# EasyEDA Pro project OLED_UI.eprj

# Schematic Schematic1
Board Name: Board1; Create Date: 2025-05-31; Page Name: P1; Project Name: OLED_UI; Schematic Name: Schematic1; Update Date: 2025-06-29; Company: 嘉立创EDA; Page Size: A4; Version: V1.0
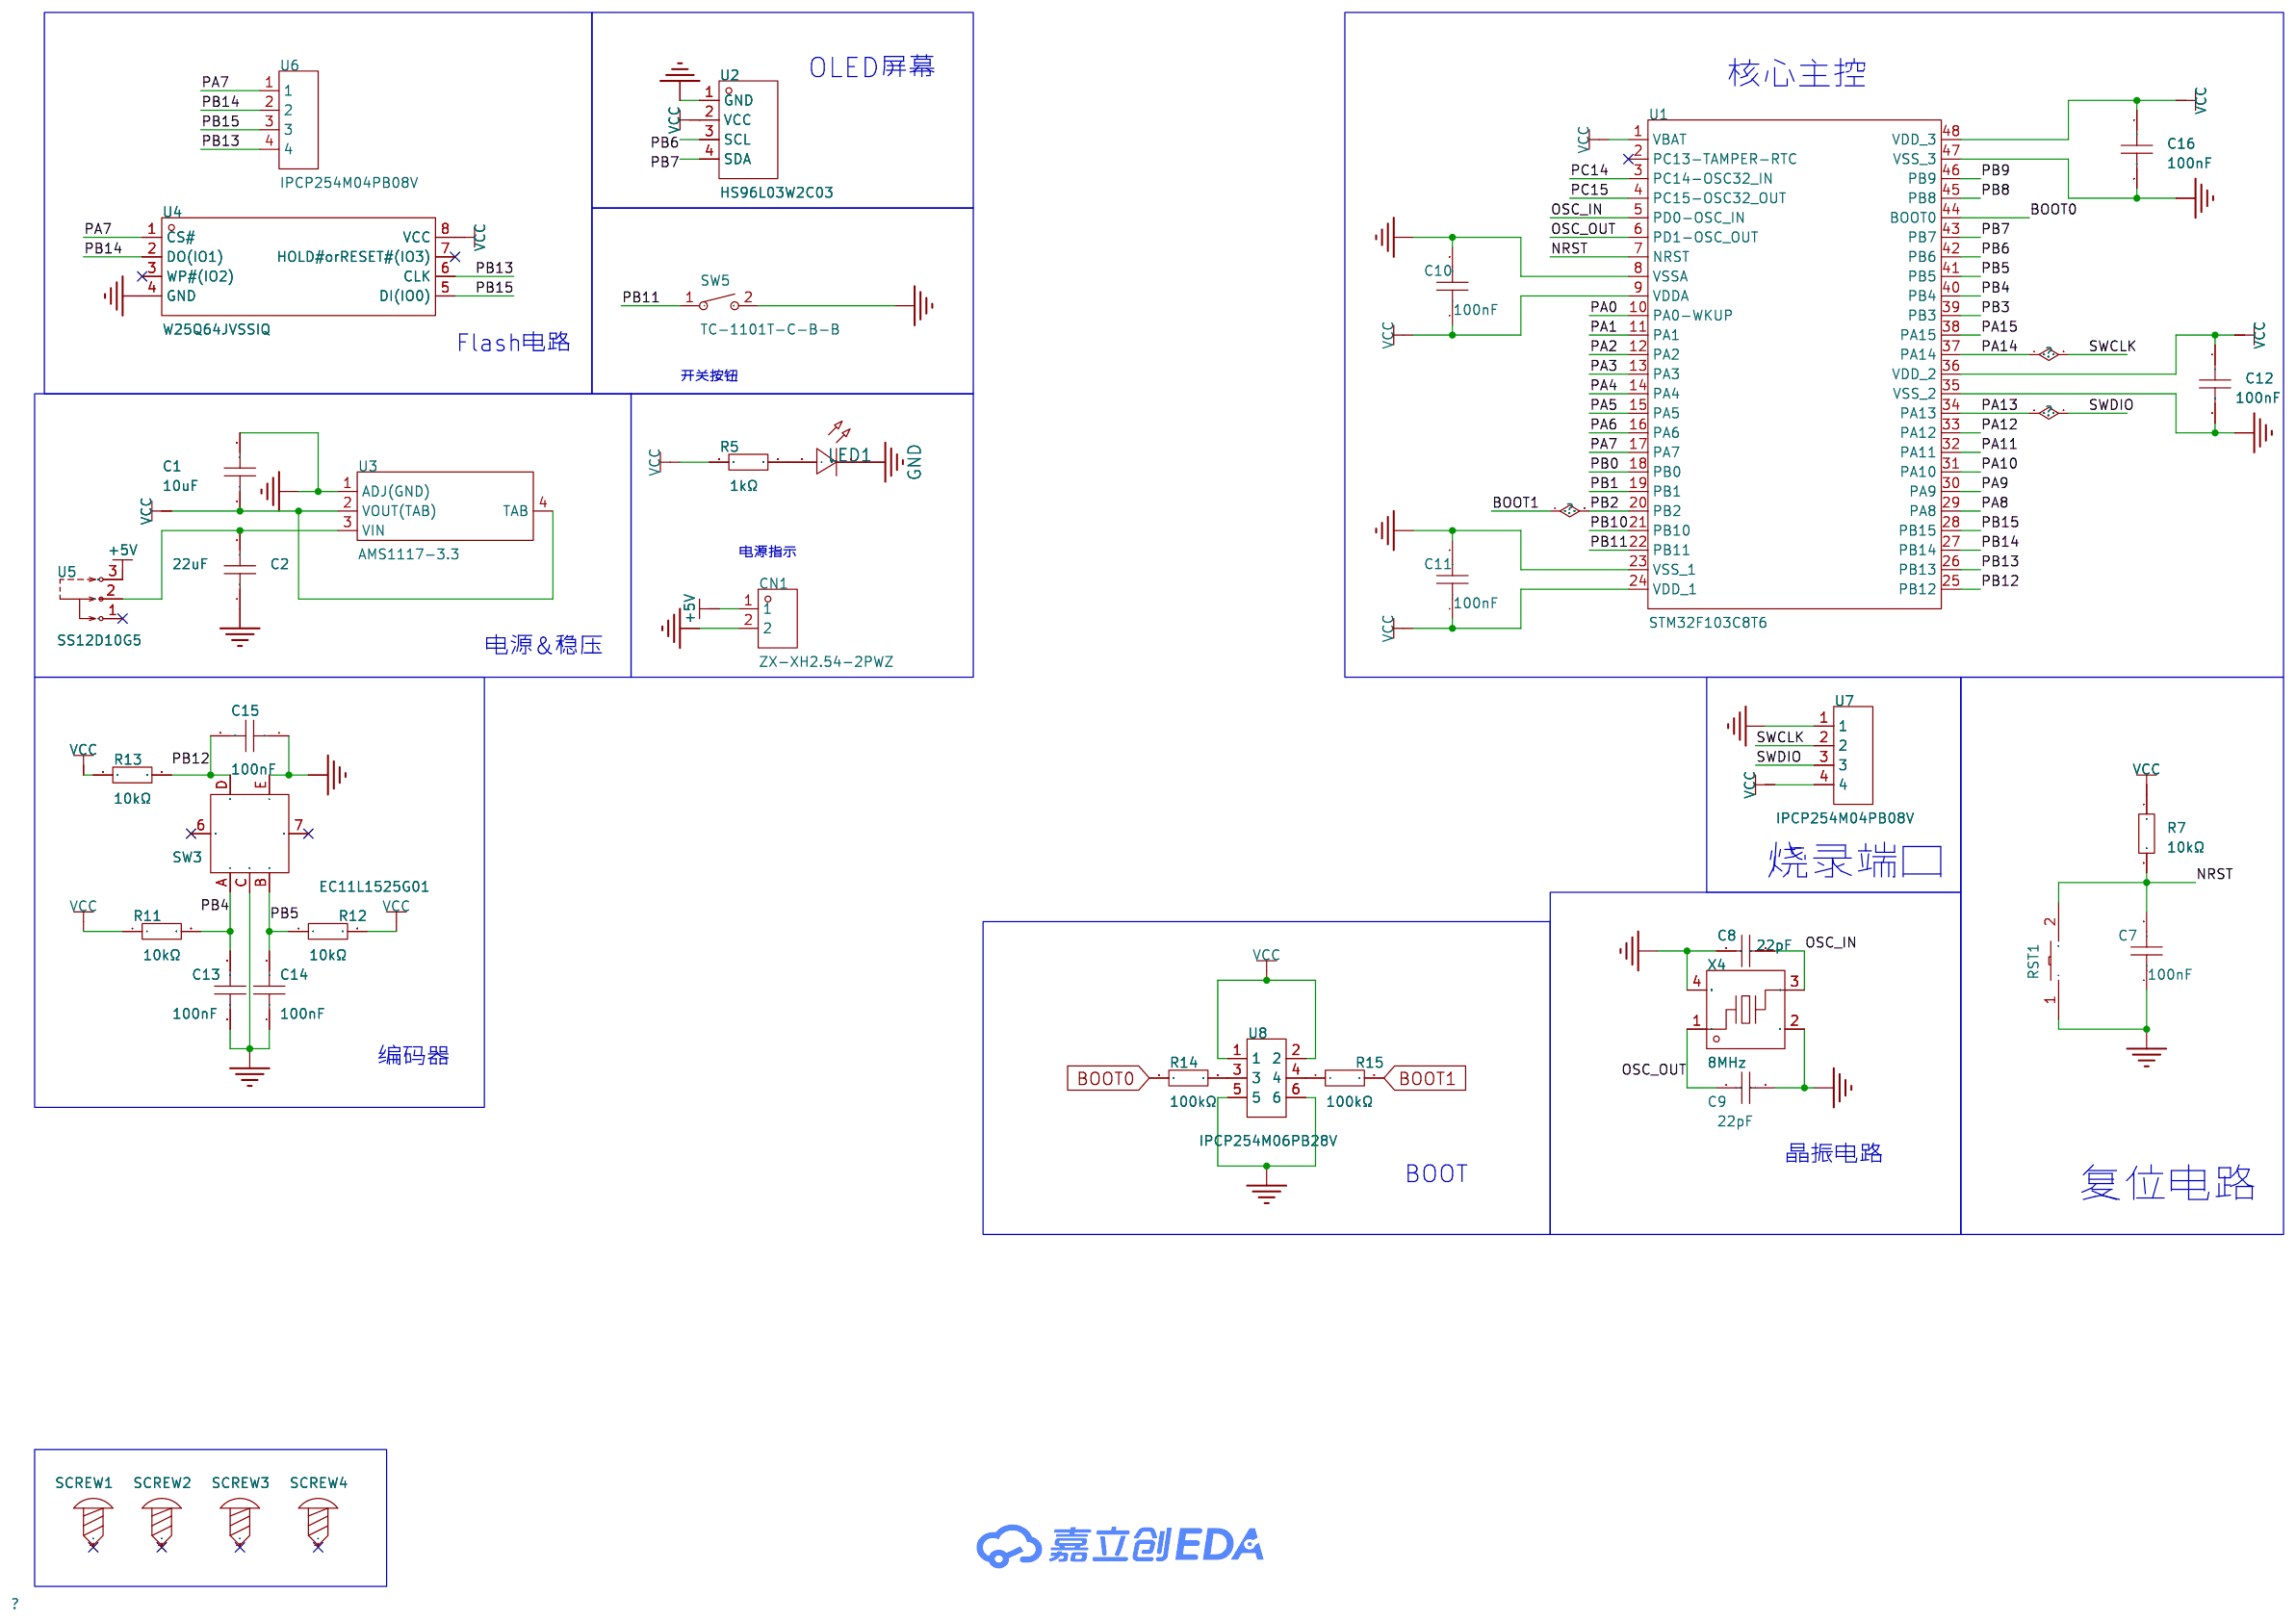
[diagram p0: schematic sheet]

## Parts
C1  10uF  [C0603]
C2  22uF  [C0603]
C7  100nF  [C0603]
C8  22pF  [C0603]
C9  22pF  [C0603]
C10  100nF  [C0603]
C11  100nF  [C0603]
C12  100nF  [C0603]
C13  100nF  [C0603]
C14  100nF  [C0603]
C15  100nF  [C0603]
C16  100nF  [C0603]
CN1  ZX-XH2.54-2PWZ  [CONN-TH_2P-P2.50_ZX-XH2.54-2PWZ]
LED1  -  [LED_0603]
R5  1kΩ  [R0603]
R7  10kΩ  [R0603]
R11  10kΩ  [R0603]
R12  10kΩ  [R0603]
R13  10kΩ  [R0603]
R14  100kΩ  [R0603]
R15  100kΩ  [R0603]
RST1  TS-1101-C-W  [SW-SMD_L6.0-W3.3-LS8.0]
SCREW1  -  [M3螺丝]
SCREW2  -  [M3螺丝]
SCREW3  -  [M3螺丝]
SCREW4  -  [M3螺丝]
SW3  EC11L1525G01  [SW-TH_ALPS_EC11L1525G01]
SW5  TC-1101T-C-B-B  [KEY-TH_2P-L6.0-W3.5-P6.50]
U1  STM32F103C8T6  [LQFP-48_L7.0-W7.0-P0.50-LS9.0-BL]
U2  HS96L03W2C03  [OLED-TH_L27.8-W27.2-P2.54_C9900033791]
U3  AMS1117-3.3  [SOT-223-4_L6.5-W3.5-P2.30-LS7.0-BR]
U4  W25Q64JVSSIQ  [SOIC-8_L5.3-W5.3-P1.27-LS8.0-BL]
U5  SS12D10G5  [SW-TH_SHOU-HAN_SS12D10G4]
U6  IPCP254M04PB08V  [HDR-TH_4P-P2.54-V-M-1]
U7  IPCP254M04PB08V  [HDR-TH_4P-P2.54-V-M-1]
U8  IPCP254M06PB28V  [HDR-TH_6P-P2.54-V-M-R2-C3-S2.54-2]
X4  8MHz  [CRYSTAL-SMD_4P-L3.2-W2.5-BL]

## Library data of the parts
C1 C2 = CAP_0603: Supplier Footprint: 0603
C7 C10-C16 = CC0603KRX7R9BB104: 容值:100nF;精度:±10%;额定电压:50V;材质(温度系数):X7R;; LCSC Part Name: 100nF ±10% 50V; Supplier Part: C14663; Manufacturer: YAGEO(国巨); Supplier Footprint: 0603; JLCPCB Part Class: 基础库; Datasheet: https://atta.szlcsc.com/upload/public/pdf/source/20180910/C282072_33301C7F631E79921B82A8DAC6BCC5B3.pdf; Supplier: LCSC; Tolerance: ±10%; Voltage Rated: 50V; Temperature Coefficient: X7R
C8 C9 = CC0603JRNPO9BN220: 容值:22pF;精度:±5%;额定电压:50V;材质(温度系数):NP0;; LCSC Part Name: 22pF ±5% 50V; Supplier Part: C105620; Manufacturer: YAGEO(国巨); Supplier Footprint: 0603; JLCPCB Part Class: 扩展库; Datasheet: https://atta.szlcsc.com/upload/public/pdf/source/20170505/1493957838062.pdf; Supplier: LCSC; Tolerance: ±5%; Voltage Rated: 50V; Temperature Coefficient: NP0
CN1 = ZX-XH2.54-2PWZ: LCSC Part Name: 1x2P 间距:2.5mm 弯插 系列:XH; Supplier Part: C7429641; Manufacturer: Megastar(兆星); Supplier Footprint: 弯插,P=2.5mm; JLCPCB Part Class: 扩展库; Datasheet: https://atta.szlcsc.com/upload/public/pdf/source/20230619/56AE8F2E01CDFEAA97FC89B5ED558AB5.pdf; Supplier: LCSC; Pins Structure: 1x2P; Pitch: 2.5mm; Mounting Type: 弯插; Reference Series: XH; Number of Pins: 2P; Number of Rows: 1; Number of PINs Per Row: 2; Rated Current: 3A; Contact Material: 黄铜; Contact Plating: 锡; Operating Temperature: -25℃~+85℃; Rated Voltage (Max): 250V; Plastic Material: PA66; Flame Retardant Rating: UL94V-0; Color: 白色; Z-Height of the Board: 5.9mm; X-Length of Bottom Edge on Board (Spacing Line): 7.5mm; Y-Width of Bottom Edge on Board: 7.32mm
LED1 = LED_0603-R: Supplier Footprint: 0603
R5 R7 R11-R15 = 0603WAF1002T5E: 电阻类型:厚膜电阻;阻值:10kΩ;精度:±1%;功率:100mW;温度系数:±100ppm/;最大工作电压:75V;工作温度范围:-55~+155;; LCSC Part Name: 10kΩ ±1% 100mW; Supplier Part: C25804; Manufacturer: UNI-ROYAL(厚声); Supplier Footprint: 0603; JLCPCB Part Class: Basic Part; Datasheet: https://atta.szlcsc.com/upload/public/pdf/source/20200306/C422600_1E6D84923E4A46A82E41ADD87F860B5C.pdf; Supplier: LCSC; Type: 厚膜电阻; Tolerance: ±1%; Power(Watts): 100mW; Temperature Coefficient: ±100ppm/; Overload Voltage (Max): 75V; Operating Temperature Range: -55~+155
RST1 = TS-1101-C-W: 触点电流:50mA;额定电压(DC):12V;绝缘电阻:100mΩ;电路结构:单刀单掷;安装方式:立贴;按钮形状:矩形按钮;按钮/盖帽颜色:白色;带灯:无;作用力:260gf;机械寿命:50000;工作温度:-30~+85;开关长度:6mm;开关宽度:3.6mm;开关高度:2.5mm;带支架:否;; LCSC Part Name: TS-1101-C-W 一型3*6*2.5有白ZD b拉伸白色按键 卷装; Supplier Part: C318938; Manufacturer: XKB Connectivity(中国星坤); Supplier Footprint: SMD; JLCPCB Part Class: Extended Part; Datasheet: https://atta.szlcsc.com/upload/public/pdf/source/20200227/C318938_C2E53B1EEDE37D980A33616AC086DE53.pdf; Supplier: LCSC; Contact Current: 50mA; Voltage Rating (DC): 12V; Insulation Resistance: 100mΩ; Circuit: 单刀单掷; Mounting Style: 立贴; Actuator Style: 矩形按钮; Actuator/Cap Color: 白色; With Lamp: 无; Operating Force: 260gf; Mechanical Life: 50000; Operating Temperature: -30~+85; Switch Length: 6mm; Switch Width: 3.6mm; Switch Height: 2.5mm; Strike Gundam: 否
SCREW1-SCREW4 = M3螺丝: Supplier Footprint: 插件
SW3 = EC11L1525G01: Supplier Part: C2991196; Manufacturer: ALPSALPINE(阿尔卑斯阿尔派); Supplier Footprint: 插件; JLCPCB Part Class: 扩展库; Datasheet: https://atta.szlcsc.com/upload/public/pdf/source/20220411/178C78D91D042177C355D008FA29ADBD.pdf; Supplier: LCSC
SW5 = TC-1101T-C-B-B: LCSC Part Name: 6*3.5*5mm 直插 轻触开关; Supplier Part: C500068; Manufacturer: XKB Connectivity(中国星坤); Supplier Footprint: 插件; JLCPCB Part Class: 扩展库; Datasheet: https://atta.szlcsc.com/upload/public/pdf/source/20211011/B69A8CD93B4DADD1FF98516D35420DE2.pdf; Supplier: LCSC; Circuit: 单刀单掷; Actuator Style: 矩形按钮; Operating Force: 260gf; Mounting Style: 直插; Switch Length: 6mm; Switch Width: 3.5mm; Switch Height: 5mm; Strike Gundam: 不带; Contact Current: 50mA; Voltage Rating (DC): 12V; Actuator/Cap Color: 黑色; With Lamp: 无; Pin Style: PC引脚; Mechanical Life: 5万次; Operating Temperature: -20℃~+70℃
U1 = STM32F103C8T6: LCSC Part Name: 主流增强型ARM Cortex-M3 MCU，具有64 KB Flash、72 MHz CPU、电机控制、USB和CAN; Supplier Part: C8734; Manufacturer: ST(意法半导体); Supplier Footprint: LQFP-48(7x7); JLCPCB Part Class: 扩展库; Datasheet: https://atta.szlcsc.com/upload/public/pdf/source/20220812/8363ACEC51AD55ECEB84799464F7CB85.pdf; Supplier: LCSC; CPU Core: ARM-M3; CPU Maximum Speed: 72MHz; Program Storage Size: 64KB; Program Memory Type: FLASH; Number of I/O: 37; ADC (Bit): 12bit; Voltage - Supply: 2V~3.6V
U2 = HS96L03W2C03: LCSC Part Name: 0.96寸OLED显示屏窄白光IIC; Supplier Part: C5248080; Manufacturer: HS(汉昇); JLCPCB Part Class: 扩展库; Datasheet: https://atta.szlcsc.com/upload/public/pdf/source/20230627/763D01F79A90007632F098068C7C8AD9.pdf; Supplier: LCSC; Main Control Chip: SSD1315; Interface Type: I2C; Size: 0.96; Pixel Resolution: 128x64; Operating Temperature: -40℃~+70℃
U3 = AMS1117-3.3_C347222: LCSC Part Name: 输出:3.3V 电流:1A 耐压:12V; Supplier Part: C347222; Manufacturer: UMW(友台半导体); Supplier Footprint: SOT-223; JLCPCB Part Class: 扩展库; Datasheet: https://atta.szlcsc.com/upload/public/pdf/source/20241218/BAF0263FA2E44BCD8AF41AA4FA04EFAA.pdf; Supplier: LCSC; Output Type: 固定; Voltage - Supply: 12V; Output Voltage: 3.3V; Output Current: 1A; Power Supply Rejection Ratio (PSRR): 60dB@(120Hz); Voltage Dropout: 1.3V@(1A); Features: 过流保护; Output Configuration: 正极; Number of Outputs: 1
U4 = W25Q64JVSSIQ: Supplier Part: C179171; Manufacturer: WINBOND(华邦); Supplier Footprint: SOIC-8-208mil; JLCPCB Part Class: 扩展库; Datasheet: https://atta.szlcsc.com/upload/public/pdf/source/20191218/C179171_92C5C91D0324539EDD8F1160D2E79C0F.pdf; Supplier: LCSC
U5 = SS12D10G5: LCSC Part Name: 两档立式插件 3脚拨动开关 柄长5.0mm; Supplier Part: C7431054; Manufacturer: SHOU HAN(首韩); Supplier Footprint: 插件; JLCPCB Part Class: 扩展库; Datasheet: https://atta.szlcsc.com/upload/public/pdf/source/20231130/7A3DB6A149BF0A1DCFFE64FFC07FE434.pdf; Supplier: LCSC; Circuit: 单刀双掷; Switch Length: 12.7mm; Switch Width: 6.7mm; Mounting Style: 直插; Current Rating (DC): 2A; Voltage Rating (DC): 125V; Mechanical Life: 3千次; Operating Temperature: -25℃~+70℃
U6 U7 = IPCP254M04PB08V: LCSC Part Name: 1x4P 间距:2.54mm 方针 直插; Supplier Part: C22438419; Manufacturer: INCP; Supplier Footprint: 插件,P=2.54mm; JLCPCB Part Class: 扩展库; Datasheet: https://atta.szlcsc.com/upload/public/pdf/source/20240509/C3DB7D997E7C6ED07E93F20304526123.pdf; Supplier: LCSC; Pin Structure: 1x4P; Pitch: 2.54mm; Circluar Pins/Square Pins: 方针; Mounting Type: 直插; Number of Rows: 单排; Number of Pins: 4P; Current Rating: 3A; Insulation Height: 2.5mm; Contact Material: 黄铜; Contact Plating: 金; Operating Temperature: -40℃~+105℃; Color: 黑色
U8 = IPCP254M06PB28V: LCSC Part Name: 2x3P 间距:2.54mm 方针 直插; Supplier Part: C22438439; Manufacturer: INCP; Supplier Footprint: 插件,P=2.54mm; JLCPCB Part Class: 扩展库; Datasheet: https://atta.szlcsc.com/upload/public/pdf/source/20240509/F9FE0EB0E4421F6EC6181D0CE2F0365A.pdf; Supplier: LCSC; Pin Structure: 2x3P; Pitch: 2.54mm; Row Spacing: 2.54mm; Circluar Pins/Square Pins: 方针; Mounting Type: 直插; Number of Rows: 双排; Number of Pins: 6P; Current Rating: 3A; Insulation Height: 2.5mm; Contact Material: 铜合金; Contact Plating: 金; Operating Temperature: -40℃~+105℃; Color: 黑色
X4 = X32258MSB4SI: LCSC Part Name: YSX321SL 8MHZ 4P 3225 20PF ±10PPM -40~85℃ (±20PPM); Supplier Part: C2682774; Manufacturer: YXC(扬兴晶振); Supplier Footprint: SMD3225-4P; JLCPCB Part Class: 扩展库; Datasheet: https://atta.szlcsc.com/upload/public/pdf/source/20240329/19D5F850207469550BEB00D7DFEDBC7A.pdf; Supplier: LCSC; Type: 贴片晶振; Normal temperature Frequency Tolerance: ±10ppm; Load Capacitance: 20pF; Frequency Stability: ±20ppm; Equivalent Series Resistance(ESR): 120Ω; Operating Temperature: -40℃~+85℃

## Nets
+5V: CN1.1 U5.3
GND: C1.2 C2.1 C7.1 C8.1 C9.2 C10.2 C11.2 C12.2 C13.1 C14.1 C15.1 C16.2 CN1.2 LED1.1(C) RST1.1 SW3.C SW3.E SW5.2 U1.8(VSSA) U1.23(VSS_1) U1.35(VSS_2) U1.47(VSS_3) U2.1(GND) U3.1(ADJ(GND)) U4.4(GND) U7.1 U8.5 U8.6 X4.2(GND) X4.4(GND)
VCC: C1.1 C10.1 C11.1 C12.1 C16.1 R5.1 R7.1 R11.1 R12.2 R13.1 U1.1(VBAT) U1.9(VDDA) U1.24(VDD_1) U1.36(VDD_2) U1.48(VDD_3) U2.2(VCC) U3.2(VOUT(TAB)) U3.4(TAB) U4.8(VCC) U7.4 U8.1 U8.2
BOOT0: R14.1 U1.44(BOOT0)
BOOT1: R15.2 U1.20(PB2)
NRST: C7.2 R7.2 RST1.2 U1.7(NRST)
OSC_IN: C8.2 U1.5(PD0-OSC_IN) X4.3
OSC_OUT: C9.1 U1.6(PD1-OSC_OUT) X4.1
PA0: U1.10(PA0-WKUP)
PA1: U1.11(PA1)
PA2: U1.12(PA2)
PA3: U1.13(PA3)
PA4: U1.14(PA4)
PA5: U1.15(PA5)
PA6: U1.16(PA6)
PA7: U1.17(PA7) U4.1(CS#) U6.1
PA8: U1.29(PA8)
PA9: U1.30(PA9)
PA10: U1.31(PA10)
PA11: U1.32(PA11)
PA12: U1.33(PA12)
PA13: U1.34(PA13) U7.3
PA14: U1.37(PA14) U7.2
PA15: U1.38(PA15)
PB0: U1.18(PB0)
PB1: U1.19(PB1)
PB3: U1.39(PB3)
PB4: C13.2 R11.2 SW3.A U1.40(PB4)
PB5: C14.2 R12.1 SW3.B U1.41(PB5)
PB6: U1.42(PB6) U2.3(SCL)
PB7: U1.43(PB7) U2.4(SDA)
PB8: U1.45(PB8)
PB9: U1.46(PB9)
PB10: U1.21(PB10)
PB11: SW5.1 U1.22(PB11)
PB12: C15.2 R13.2 SW3.D U1.25(PB12)
PB13: U1.26(PB13) U4.6(CLK) U6.4
PB14: U1.27(PB14) U4.2(DO(IO1)) U6.2
PB15: U1.28(PB15) U4.5(DI(IO0)) U6.3
PC14: U1.3(PC14-OSC32_IN)
PC15: U1.4(PC15-OSC32_OUT)
$1N1758: C2.2 U3.3(VIN) U5.2
$1N6702: R14.2 U8.3
$1N6807: R15.1 U8.4
$1N8151: LED1.2(A) R5.2

Not connected (* = marked no-connect by the designer): SCREW1 1*; SCREW2 1*; SCREW3 1*; SCREW4 1*; SW3 6(EH)* 7(EH)*; U1 2(PC13-TAMPER-RTC)*; U4 3(WP#(IO2))* 7(HOLD#orRESET#(IO3))*; U5 1*

## Notes on the sheet
- OLED屏幕
- 核心主控
- Flash电路
- 开关按钮
- 电源指示
- 电源&稳压
- 烧录端口
- 编码器
- 晶振电路
- BOOT
- 复位电路

# Board PCB1
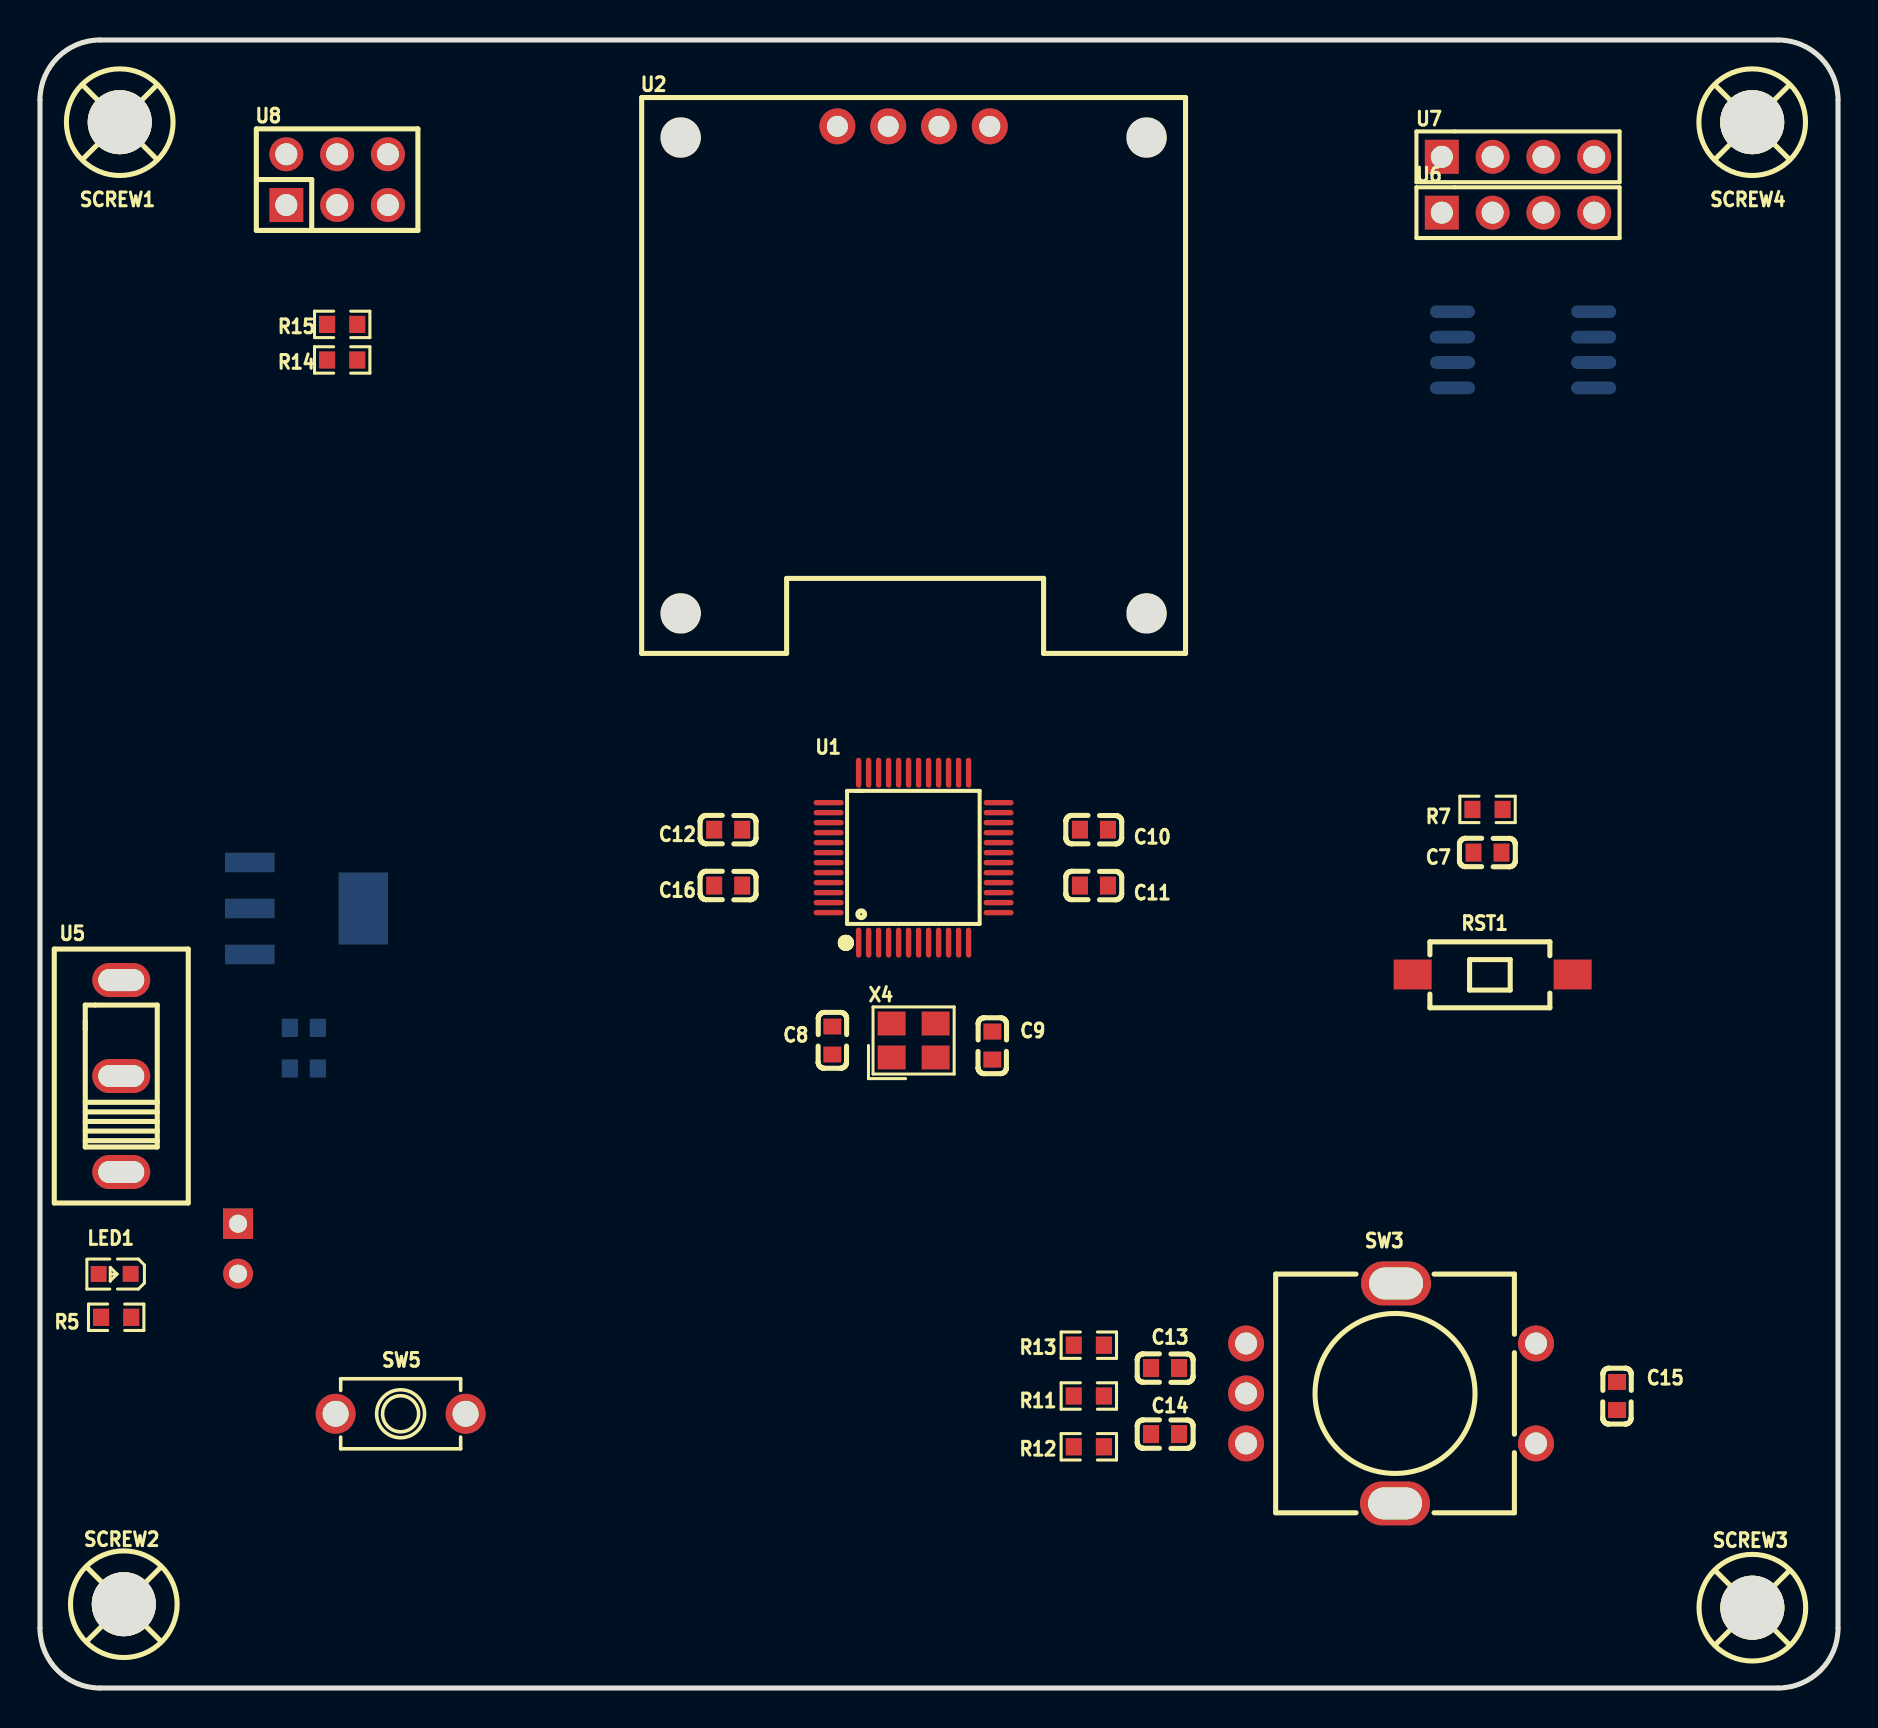
[diagram p1: board, top side]
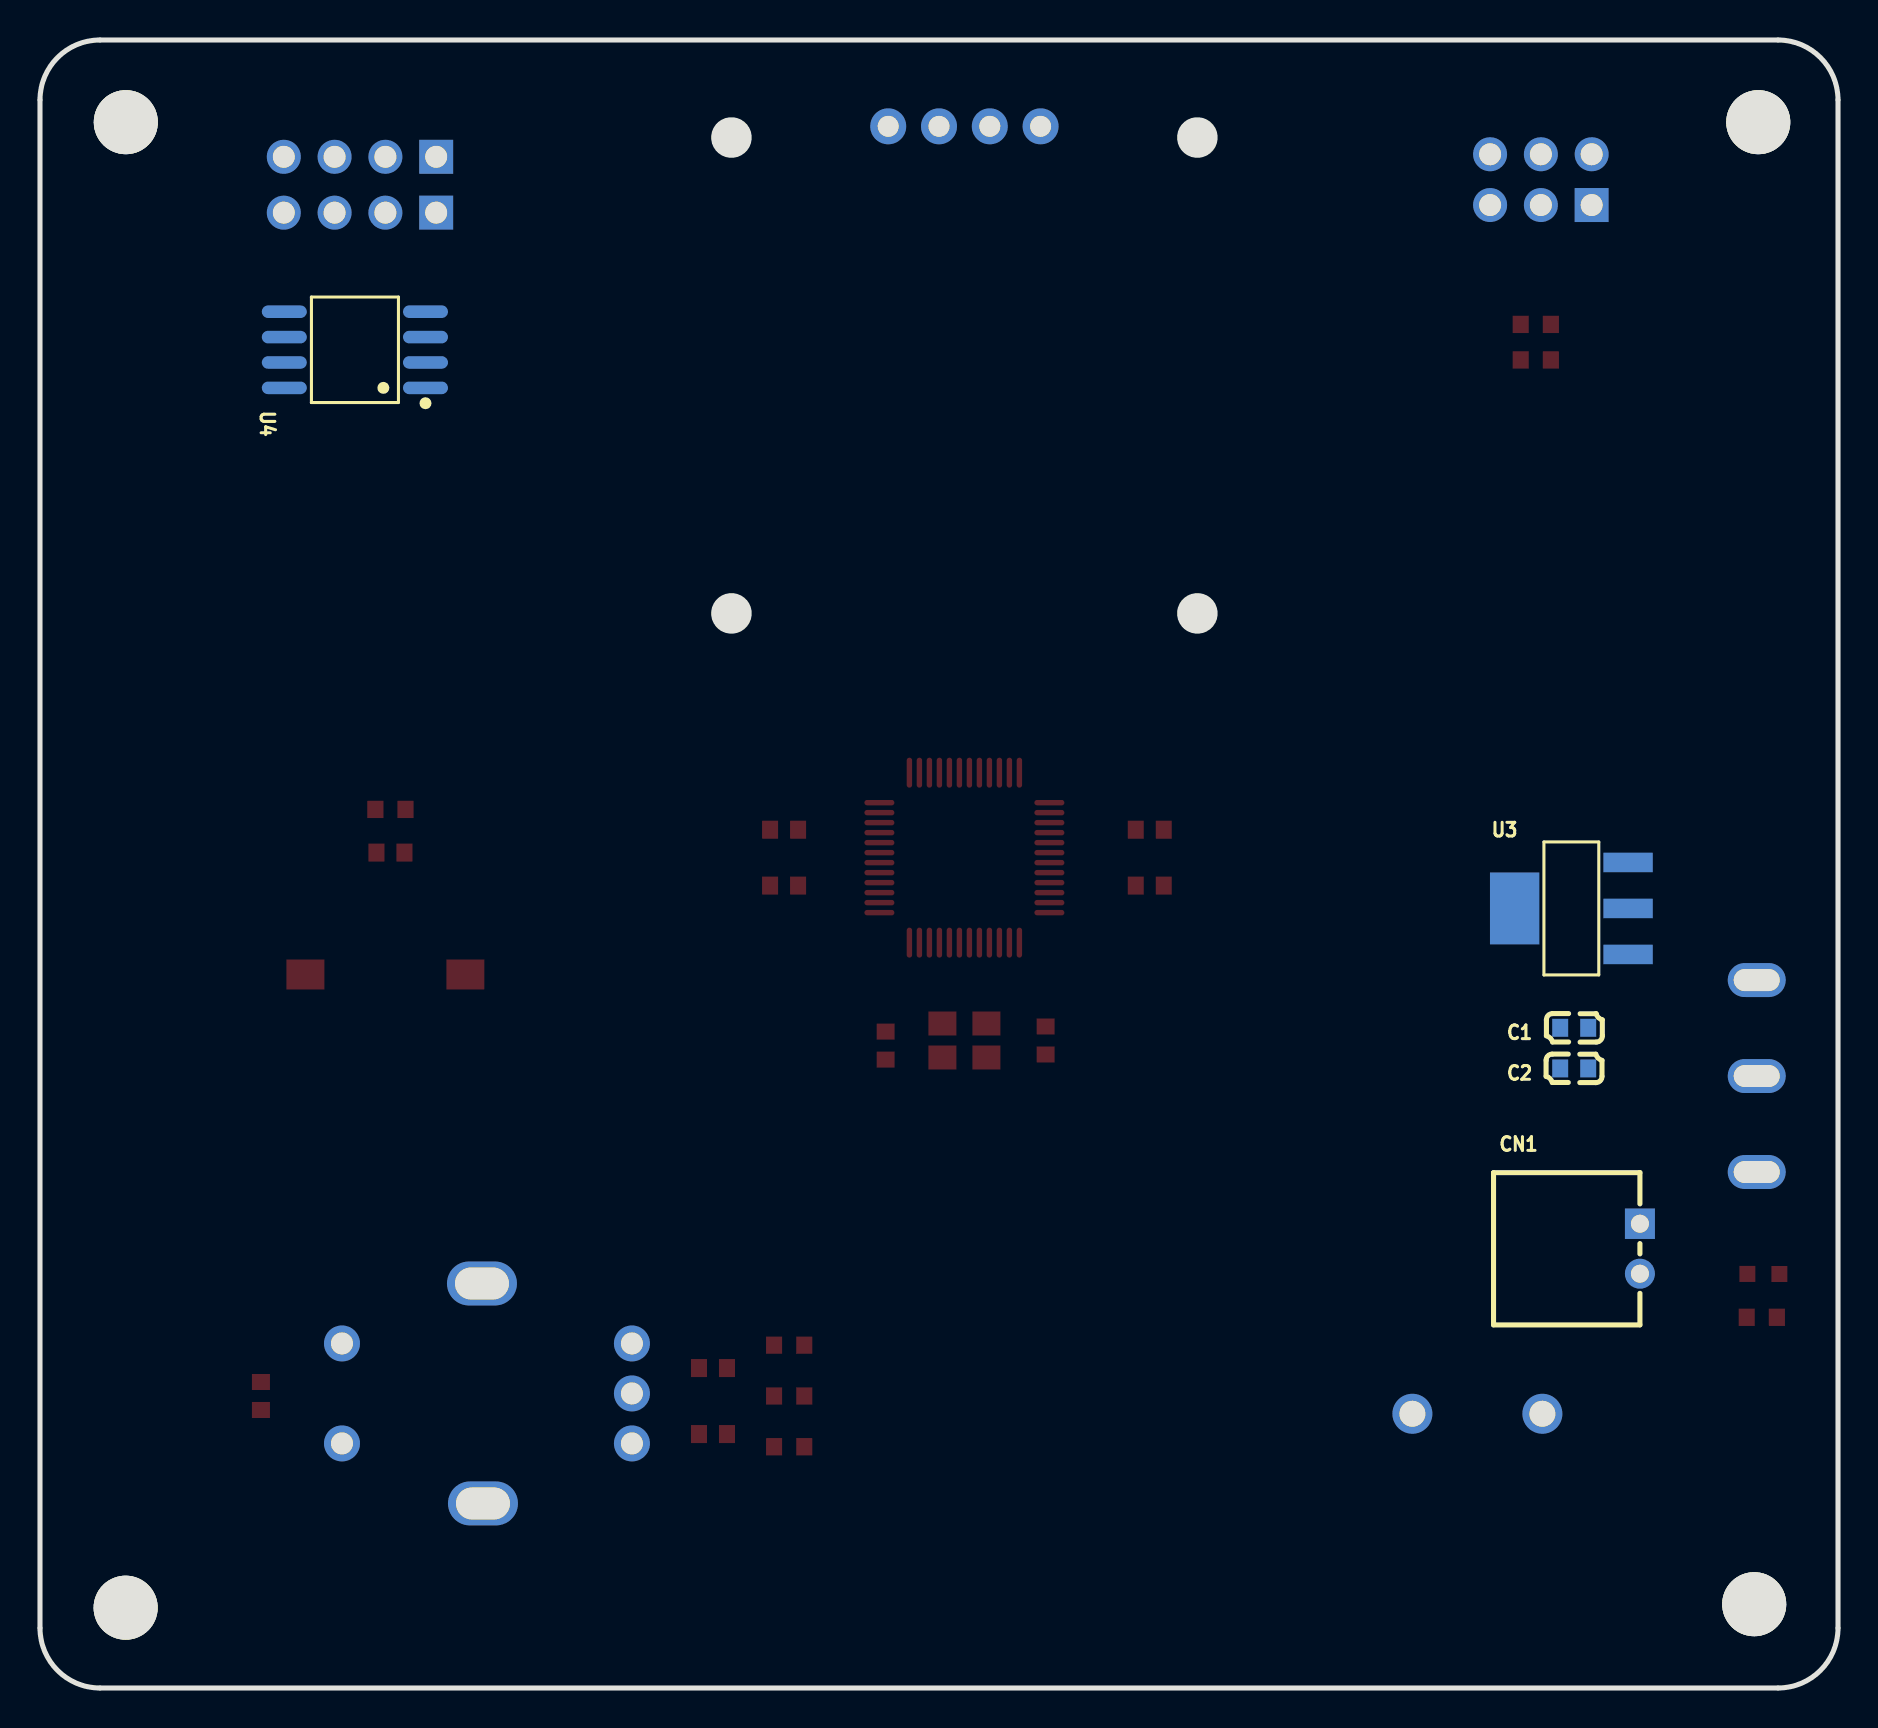
[diagram p2: board, bottom side, seen from below]

Outline 89.92 x 82.42 mm; copper layers: Top Layer, Bottom Layer. Coordinates in mm from the lower left corner of the outline.
Outline path: 0,79.42 arc(0.88,81.54) 3,82.42 86.92,82.42 arc(89.04,81.54) 89.92,79.42 89.92,3 arc(89.04,0.88) 86.92,0 3,0 arc(0.88,0.88) 0,3 0,79.42
Stack: Top Layer 0.035mm / Dielectric1 1.51mm FR4 er 4.5 / Bottom Layer 0.035mm

## Design rules (mm)
template: JLCPCB Capability(Two Layers Board)
spacing copperThickness1oz (default): track to track 0.102, other pairs 0.152 to 0.3
spacing copperThickness2oz: track to track 0.203, other pairs 0.152 to 0.3
track width copperThickness1oz (default): min 0.127, default 0.254, max 2.54
track width copperThickness2oz: min 0.203, default 0.254, max 2.54
differential pair differentialPair (default): width min 0.127, default 0.254, max 2.54; gap min 0.152, default 0.152
via viaSize (default): diameter min 0.5, default 0.61, max 10; hole min 0.3, default 0.305, max 6.3

## Placement (name value [footprint] x y rotation side)
C1  10uF  [C0603]  13.19 33.02 0 bottom
C2  22uF  [C0603]  13.19 30.99 180 bottom
C7  100nF  [C0603]  72.39 41.78 0 top
C8  22pF  [C0603]  39.62 32.39 270 top
C9  22pF  [C0603]  47.62 32.13 90 top
C10  100nF  [C0603]  52.71 42.93 0 top
C11  100nF  [C0603]  52.71 40.13 0 top
C12  100nF  [C0603]  34.42 42.93 0 top
C13  100nF  [C0603]  56.26 16 180 top
C14  100nF  [C0603]  56.26 12.7 180 top
C15  100nF  [C0603]  78.87 14.61 90 top
C16  100nF  [C0603]  34.42 40.13 0 top
CN1  ZX-XH2.54-2PWZ  [CONN-TH_2P-P2.50_ZX-XH2.54-2PWZ]  9.91 21.97 270 bottom
LED1  -  [LED_0603]  3.68 20.7 180 top
R5  1kΩ  [R0603]  3.81 18.54 0 top
R7  10kΩ  [R0603]  72.39 43.94 0 top
R11  10kΩ  [R0603]  52.45 14.61 0 top
R12  10kΩ  [R0603]  52.45 12.06 180 top
R13  10kΩ  [R0603]  52.45 17.14 0 top
R14  100kΩ  [R0603]  15.11 66.42 0 top
R15  100kΩ  [R0603]  15.11 68.2 0 top
RST1  TS-1101-C-W  [SW-SMD_L6.0-W3.3-LS8.0]  72.64 35.69 0 top
SCREW1  -  [M3螺丝]  3.99 78.31 0 top
SCREW2  -  [M3螺丝]  4.19 4.19 0 top
SCREW3  -  [M3螺丝]  85.63 4.02 0 top
SCREW4  -  [M3螺丝]  85.62 78.31 0 top
SW3  EC11L1525G01  [SW-TH_ALPS_EC11L1525G01]  67.56 14.73 270 top
SW5  TC-1101T-C-B-B  [KEY-TH_2P-L6.0-W3.5-P6.50]  18.03 13.72 180 top
U1  STM32F103C8T6  [LQFP-48_L7.0-W7.0-P0.50-LS9.0-BL]  43.69 41.53 0 top
U2  HS96L03W2C03  [OLED-TH_L27.8-W27.2-P2.54_C9900033791]  43.69 78.11 0 top
U3  AMS1117-3.3  [SOT-223-4_L6.5-W3.5-P2.30-LS7.0-BR]  13.33 38.99 180 bottom
U4  W25Q64JVSSIQ  [SOIC-8_L5.3-W5.3-P1.27-LS8.0-BL]  74.17 66.93 90 bottom
U5  SS12D10G5  [SW-TH_SHOU-HAN_SS12D10G4]  4.06 30.61 90 top
U6  IPCP254M04PB08V  [HDR-TH_4P-P2.54-V-M-1]  73.91 73.79 0 top
U7  IPCP254M04PB08V  [HDR-TH_4P-P2.54-V-M-1]  73.91 76.58 0 top
U8  IPCP254M06PB28V  [HDR-TH_6P-P2.54-V-M-R2-C3-S2.54-2]  14.86 75.44 0 top
X4  8MHz  [CRYSTAL-SMD_4P-L3.2-W2.5-BL]  43.69 32.39 0 top

## Footprints (pads in the part's own frame, mm; a bottom-side part is the same pattern mirrored in y, then rotated)
C0603
  rect 0.8x0.9 smd: 1(-0.7,0) 2(0.7,0)
CONN-TH_2P-P2.50_ZX-XH2.54-2PWZ
  rect 1.524x1.5 hole 0.9: 1(-1.25,0)
  round 1.5 hole 0.9: 2(1.25,0)
CRYSTAL-SMD_4P-L3.2-W2.5-BL
  rect 1.4x1.2 smd: 1(-1.1,-0.85) 2(1.1,-0.85) 3(1.1,0.85) 4(-1.1,0.85)
HDR-TH_4P-P2.54-V-M-1
  rect 1.7x1.7 hole 1.1: 1(-3.81,0)
  round 1.7 hole 1.1: 2(-1.27,0) 3(1.27,0) 4(3.81,0)
HDR-TH_6P-P2.54-V-M-R2-C3-S2.54-2
  rect 1.7x1.7 hole 1.1: 1(-2.54,-1.27)
  round 1.7 hole 1.1: 2(-2.54,1.27) 3(0,-1.27) 4(0,1.27) 5(2.54,-1.27) 6(2.54,1.27)
KEY-TH_2P-L6.0-W3.5-P6.50
  round 2 hole 1.3: 1(-3.25,0) 2(3.25,0)
LED_0603
  rect 0.8x0.8 smd: 1(-0.851,-0.01) 2(0.75,-0.005)
LQFP-48_L7.0-W7.0-P0.50-LS9.0-BL
  oval 0.27x1.5 smd: 1(-2.75,-4.25) 2(-2.25,-4.25) 3(-1.75,-4.25) 4(-1.25,-4.25) 5(-0.75,-4.25) 6(-0.25,-4.25) 7(0.25,-4.25) 8(0.75,-4.25) 9(1.25,-4.25) 10(1.75,-4.25) 11(2.25,-4.25) 12(2.75,-4.25) 25(2.75,4.25) 26(2.25,4.25) 27(1.75,4.25) 28(1.25,4.25) 29(0.75,4.25) 30(0.25,4.25) 31(-0.25,4.25) 32(-0.75,4.25) 33(-1.25,4.25) 34(-1.75,4.25) 35(-2.25,4.25) 36(-2.75,4.25)
  oval 1.5x0.27 smd: 13(4.25,-2.75) 14(4.25,-2.25) 15(4.25,-1.75) 16(4.25,-1.25) 17(4.25,-0.75) 18(4.25,-0.25) 19(4.25,0.25) 20(4.25,0.75) 21(4.25,1.25) 22(4.25,1.75) 23(4.25,2.25) 24(4.25,2.75) 37(-4.25,2.75) 38(-4.25,2.25) 39(-4.25,1.75) 40(-4.25,1.25) 41(-4.25,0.75) 42(-4.25,0.25) 43(-4.25,-0.25) 44(-4.25,-0.75) 45(-4.25,-1.25) 46(-4.25,-1.75) 47(-4.25,-2.25) 48(-4.25,-2.75)
M3螺丝
  round 3.2 hole 3.2: 1(0,0)
OLED-TH_L27.8-W27.2-P2.54_C9900033791
  round 1.8 hole 1.05: 1(-3.81,0) 2(-1.27,0) 3(1.27,0) 4(3.81,0)
R0603
  rect 0.806x0.864 smd: 1(-0.753,0) 2(0.753,0)
SOIC-8_L5.3-W5.3-P1.27-LS8.0-BL
  oval 0.63x2.25 smd: 1(-1.905,-3.53) 2(-0.635,-3.53) 3(0.635,-3.53) 4(1.905,-3.53) 5(1.905,3.53) 6(0.635,3.53) 7(-0.635,3.53) 8(-1.905,3.53)
SOT-223-4_L6.5-W3.5-P2.30-LS7.0-BR
  rect 2.47x0.98 smd: 1(2.835,-2.3) 2(2.835,0) 3(2.835,2.3)
  rect 2.47x3.6 smd: 4(-2.835,0)
SW-SMD_L6.0-W3.3-LS8.0
  rect 1.9x1.5 smd: 1(-4,0) 2(4,0)
SW-TH_ALPS_EC11L1525G01
  oval 2.2x3.5 hole 1.6x2.7: 6(-5.5,0.25) 7(5.5,0.2)
  round 1.8 hole 1.1: A(-2.5,-7.25) B(2.5,-7.25) C(0,-7.25) D(-2.5,7.25) E(2.5,7.25)
SW-TH_SHOU-HAN_SS12D10G4
  oval 1.7x2.9 hole 1.1x2.3: 1(-4.8,0) 2(0,0) 3(4.8,0)

## Nets
As in the schematic.

Pads without a net: SCREW1 1; SCREW2 1; SCREW3 1; SCREW4 1; SW3 6 7; U1 2; U4 3 7; U5 1
